# EAGLE schematic Schematic_v1.0 (EAGLE 9.7.0)
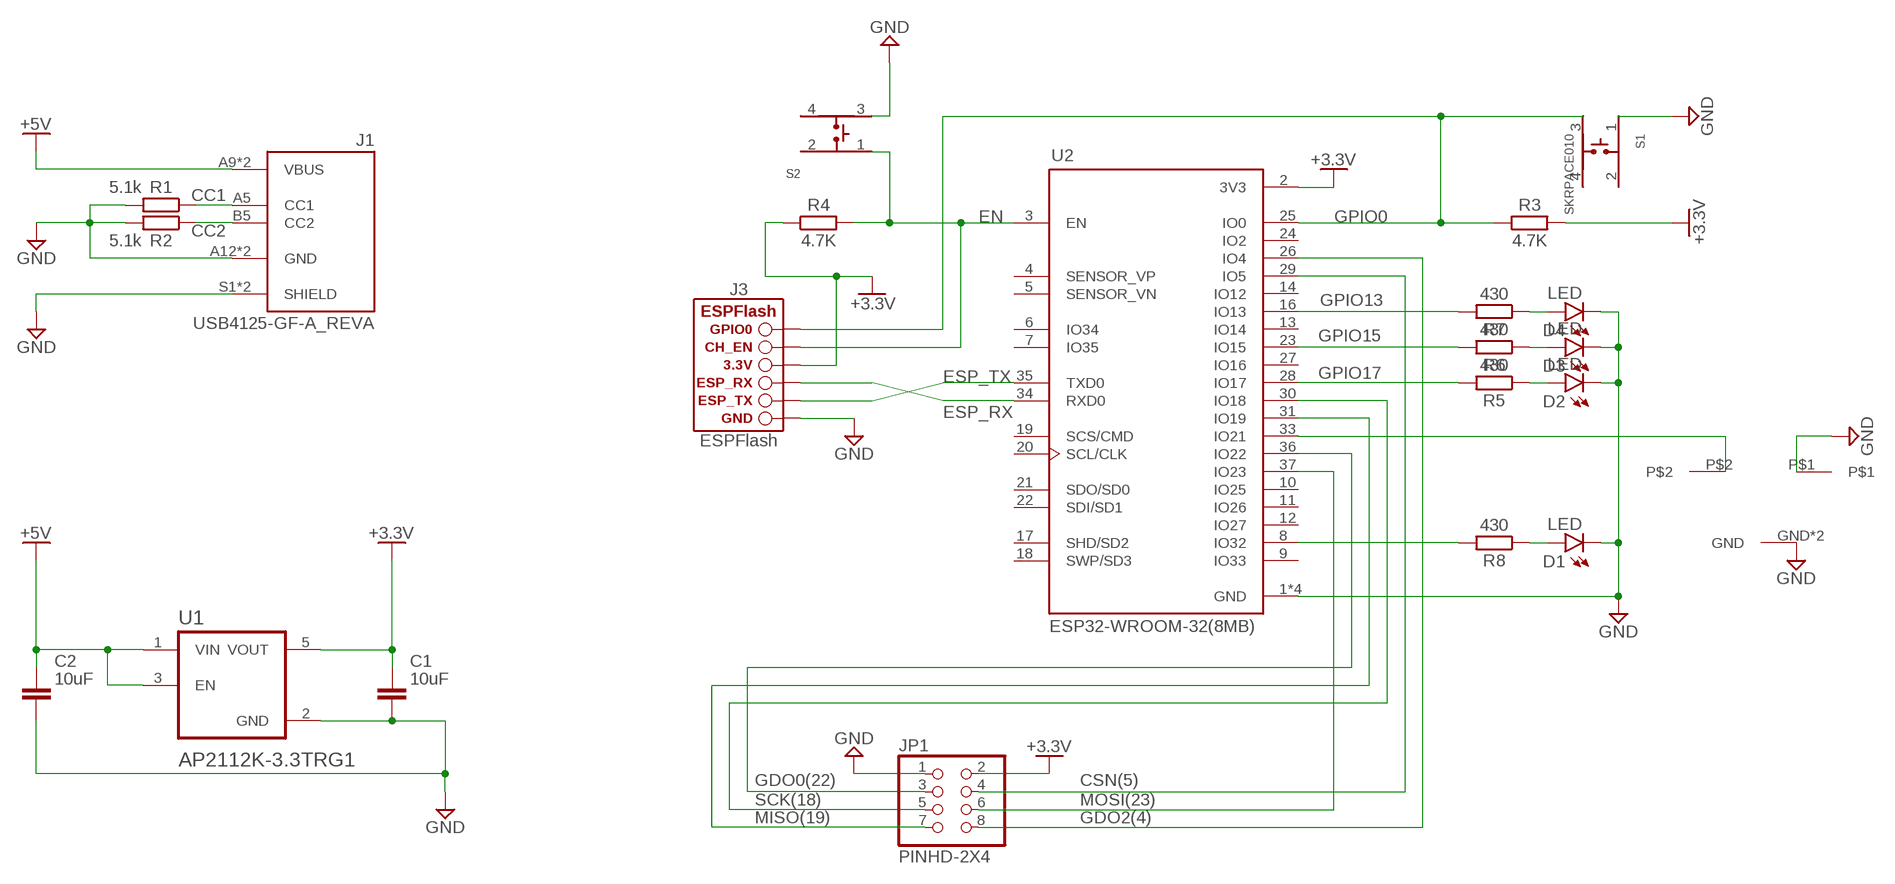
[diagram p0: schematic, sheet 1]

## Parts
C1  10uF  C_CHIP-0603(1608-METRIC)  [CAPC1608X85]
C2  10uF  C_CHIP-0603(1608-METRIC)  [CAPC1608X85]
D1  LED  CHIP-FLAT-R_0603-0.80MM  [LEDC1608X80N_FLAT-R]
D2  LED  CHIP-FLAT-R_0603-0.80MM  [LEDC1608X80N_FLAT-R]
D3  LED  CHIP-FLAT-R_0603-0.80MM  [LEDC1608X80N_FLAT-R]
D4  LED  CHIP-FLAT-R_0603-0.80MM  [LEDC1608X80N_FLAT-R]
J1  USB4125-GF-A_REVA  UJC-VP-3-SMT-TR  [CUI_UJC-VP-3-SMT-TR]
J3  ESPFLASH-2X3-2.54-PLAIN  [2X3-2.54-PLAIN]
JP1  PINHD-2X4  [2X04]
R1  5.1k  R_CHIP-0603(1608-METRIC)  [RESC1608X60]
R2  5.1k  R_CHIP-0603(1608-METRIC)  [RESC1608X60]
R3  4.7K  R_CHIP-0603(1608-METRIC)  [RESC1608X60]
R4  4.7K  R_CHIP-0603(1608-METRIC)  [RESC1608X60]
R5  430  R_CHIP-0603(1608-METRIC)  [RESC1608X60]
R6  430  R_CHIP-0603(1608-METRIC)  [RESC1608X60]
R7  430  R_CHIP-0603(1608-METRIC)  [RESC1608X60]
R8  430  R_CHIP-0603(1608-METRIC)  [RESC1608X60]
S1  SKRPACE010  [SW_SKRPACE010]
S2  SKRPACE010  [SW_SKRPACE010]
U1  AP2112K-3.3TRG1  [SOT95P285X140-5N]
U2  ESP32-WROOM-32(8MB)  [MODULE_ESP32-WROOM-32(8MB)]
U$1  MOMENTARY-SWITCH  [SWITCH-MOMENTARY]

## Nets
+3.3V [5V]: C1.1 J3.2(3.3V) JP1.2 R3.2 R4.1 U1.5(VOUT) U2.2(3V3)
+5V [5V]: C2.1 J1.A9(VBUS) J1.B9(VBUS) U1.1(VIN) U1.3(EN)
CC1: J1.A5(CC1) R1.1
CC2: J1.B5(CC2) R2.1
CSN(5): JP1.4 U2.29(IO5)
EN: J3.1(CH_EN) R4.2 S2.1 U2.3(EN)
ESP_RX: J3.5(ESP_RX) U2.34(RXD0)
ESP_TX: J3.3(ESP_TX) U2.35(TXD0)
GDO0(22): JP1.3 U2.36(IO22)
GDO2(4): JP1.8 U2.26(IO4)
GND [GND]: C1.2 C2.2 D1.C D2.C D3.C D4.C J1.A12(GND) J1.B12(GND) J1.S1(SHIELD) J1.S2(SHIELD) J3.4(GND) JP1.1 R1.2 R2.2 S1.1 S2.3 U1.2(GND) U2.1(GND) U2.15(GND) U2.38(GND) U2.39(GND) U$1.GND U$1.GND_2(GND) U$1.P$1
GPIO0: J3.6(GPIO0) R3.1 S1.3 U2.25(IO0)
GPIO13: R7.2 U2.16(IO13)
GPIO15: R6.2 U2.23(IO15)
GPIO17: R5.2 U2.28(IO17)
MISO(19): JP1.7 U2.31(IO19)
MOSI(23): JP1.6 U2.37(IO23)
N$1: D1.A R8.1
N$2: R8.2 U2.8(IO32)
N$3: D2.A R5.1
N$4: U2.33(IO21) U$1.P$2
N$5: D3.A R6.1
N$7: D4.A R7.1
SCK(18): JP1.5 U2.30(IO18)
Unconnected: S1.2 S1.4 S2.2 S2.4 U2.4(SENSOR_VP) U2.5(SENSOR_VN) U2.6(IO34) U2.7(IO35) U2.9(IO33) U2.10(IO25) U2.11(IO26) U2.12(IO27) U2.13(IO14) U2.14(IO12) U2.17(SHD/SD2) U2.18(SWP/SD3) U2.19(SCS/CMD) U2.20(SCL/CLK) U2.21(SDO/SD0) U2.22(SDI/SD1) U2.24(IO2) U2.27(IO16)

## Library data of the parts
C1 C2 = Capacitor:C: Capacitor - Generic; CATEGORY: Capacitor
D1-D4 = LED:CHIP-FLAT-R; CATEGORY: LED; COLOR: RED; DESCRIPTION: CHIP LED FLAT; SUB-CATEGORY: CHIP; TYPE: FLAT_TOP; VALUE: LED_RED
J1 = UJC-VP-3-SMT-TR:UJC-VP-3-SMT-TR: USB Receptacle; MANUFACTURER: CUI Devices; MAXIMUM_PACKAGE_HEIGHT: 6.5mm; PARTREV: 1.0; STANDARD: Manufacturer Recommendations
J3 = SuperHouse-ESPFlash:ESPFLASH: ESPFlash ESPFlash programming header for ESP8266, ESP8285, and ESP32. Options for both 1x6 and 2x3 formats, in both 2.54mm (0.1") and 1.27mm (0.05") pitch.
JP1 = Connector:PINHD-2X4: PIN HEADER; CATEGORY: CONNECTOR; SUB-CATEGORY: PIN-HEADER
R1-R8 = Resistor:R: Resistor Fixed - Generic; CATEGORY: Resistor; SUB-CATEGORY: Fixed
S1 S2 = SKRPACE010:SKRPACE010: Switch Tactile N.O. SPST Button J-Bend 0.05A 16VDC 2.55N SMD Automotive T/R; MANUFACTURER: ALPS; STANDARD: Maniufacturer Recommendations
U1 = AP2112K-3.3TRG1:AP2112K-3.3TRG1: AP2112 Series 0.6 A 3.3 V Fixed Output SMT LDO Linear Regulator - SOT23-5; MANUFACTURER: Diodes Inc.; PARTREV: 2-2
U2 = ESP32-WROOM-32_8MB_:ESP32-WROOM-32(8MB): WIFI MODULE 64 MBITS SPI FLASH; MANUFACTURER: Espressif Systems; MAXIMUM_PACKAGE_HEIGHT: 3.2mm; PARTREV: 2.7; STANDARD: Manufacturer Recommendations
U$1 = Tactile Switches:MOMENTARY-SWITCH

## Net classes
0 default: width 0.254 mm
1 5V: width 0.635 mm
2 GND: width 0.635 mm